# EAGLE design akabeacon_circle_MDBT40_type4 (EAGLE 9.6.2)
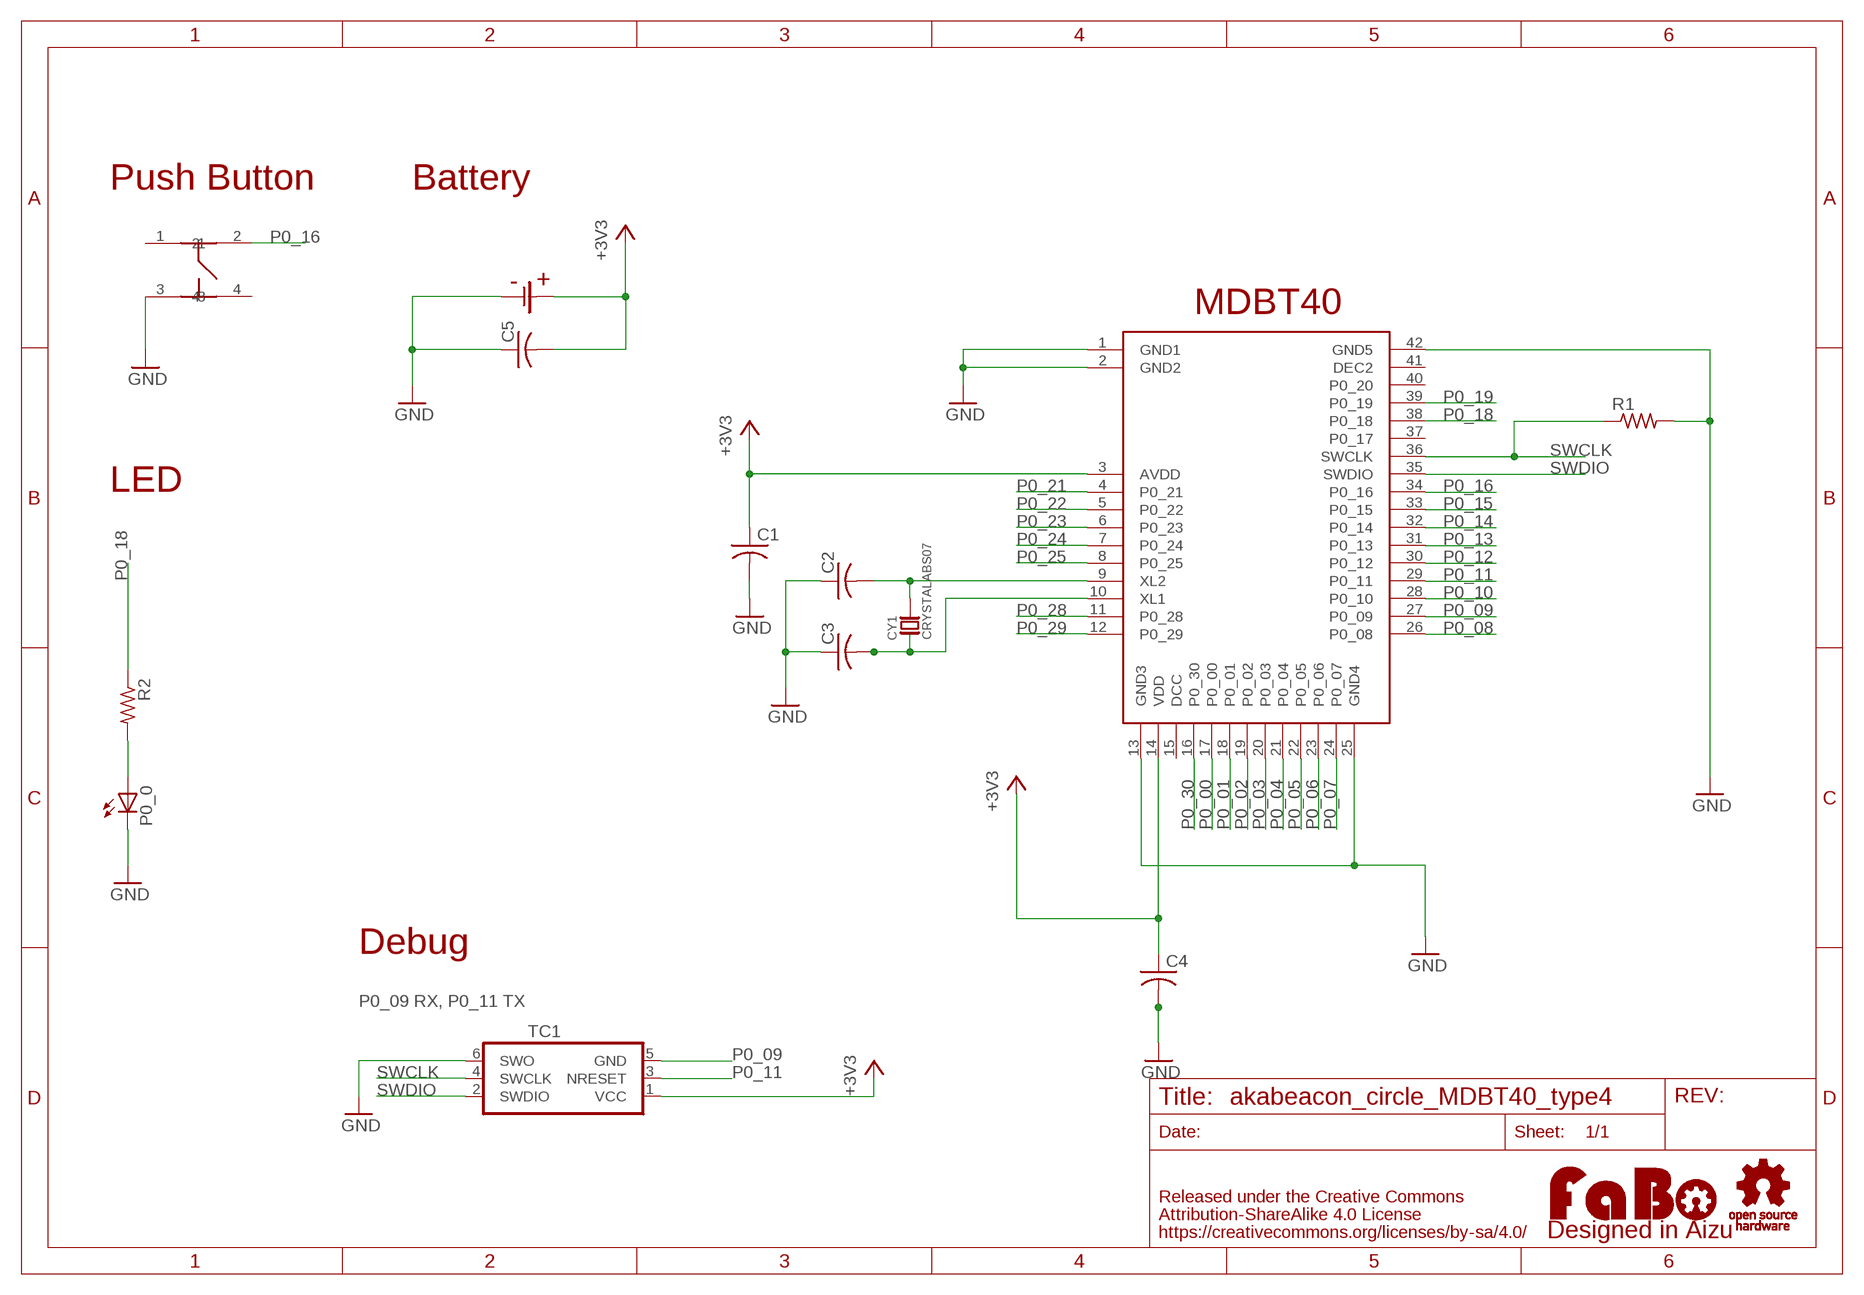
[diagram p0: schematic, sheet 1]

## Parts
C1  C-USC0603  [C0603]
C2  C-USC0603  [C0603]
C3  C-USC0603  [C0603]
C4  C-USC0603  [C0603]
C5  C-USC0603  [C0603]
CY1  CRYSTALABS07  [ABRACOM-ABS07-32.768KHZ]
P0_0  LEDCHIP-LED0603  [CHIP-LED0603]
R1  R-US_R0603  [R0603]
R2  R-US_R0603  [R0603]
TC1  TC2030-IDC-NL  [TC2030-IDC-NL]
U$1  RAYTAC-MDBT40  [RAYTAC-MDBT40]
U$2  SMTU-TOP2032  [SMTU-2032]
U$3  LOGO_FABO-M  [LOGO_FABO_MS]
U$4  LOGO_OSHW-M_BOTTOM  [LOGO_OSHW_M_BOTTOM]
U$5  SWICTH-4P(KMR2)  [SWITCH-4P(KMR2)]

## Nets
+3V3: C1.1 C4.1 C5.2 TC1.1(VCC) U$1.3(AVDD) U$1.14(VDD) U$2.+
GND: C1.2 C2.1 C3.1 C4.2 C5.1 P0_0.C R1.2 TC1.6(SWO) U$1.1(GND1) U$1.2(GND2) U$1.13(GND3) U$1.25(GND4) U$1.42(GND5) U$2.- U$5.3
N$1: P0_0.A R2.2
N$7: C2.2 CY1.P$2 U$1.9(XL2)
N$8: C3.2 CY1.P$1 U$1.10(XL1)
P0_00: U$1.17(P0_00)
P0_01: U$1.18(P0_01)
P0_02: U$1.19(P0_02)
P0_03: U$1.20(P0_03)
P0_04: U$1.21(P0_04)
P0_05: U$1.22(P0_05)
P0_06: U$1.23(P0_06)
P0_07: U$1.24(P0_07)
P0_08: U$1.26(P0_08)
P0_09: TC1.5(GND) U$1.27(P0_09)
P0_10: U$1.28(P0_10)
P0_11: TC1.3(NRESET) U$1.29(P0_11)
P0_12: U$1.30(P0_12)
P0_13: U$1.31(P0_13)
P0_14: U$1.32(P0_14)
P0_15: U$1.33(P0_15)
P0_16: U$1.34(P0_16) U$5.2
P0_18: R2.1 U$1.38(P0_18)
P0_19: U$1.39(P0_19)
P0_21: U$1.4(P0_21)
P0_22: U$1.5(P0_22)
P0_23: U$1.6(P0_23)
P0_24: U$1.7(P0_24)
P0_25: U$1.8(P0_25)
P0_28: U$1.11(P0_28)
P0_29: U$1.12(P0_29)
P0_30: U$1.16(P0_30)
SWCLK: R1.1 TC1.4(SWCLK) U$1.36(SWCLK)
SWDIO: TC1.2(SWDIO) U$1.35(SWDIO)
Unconnected: U$1.15(DCC) U$1.37(P0_17) U$1.40(P0_20) U$1.41(DEC2) U$5.1 U$5.4

## Notes on the sheet
- Push Button | Battery
- MDBT40
- LED
- Debug
- P0_09 RX, P0_11 TX

## Library data of the parts
C1-C5 = adafruit:C-US: CAPACITOR, American symbol
CY1 = FaBo-Crystal:CRYSTAL
P0_0 = led:LED: LED OSRAM: - CHIPLED LG R971, LG N971, LY N971, LG Q971, LY Q971, LO R971, LY R971 LH N974, LH R974 LS Q976, LO Q976, LY Q976 LO Q996 - Hyper CHIPLED LW Q18S LB Q993, LB Q99A, LB R99A - SideLED LS A670, LO A670, LY A670, LG A670, LP A670 LB A673, LV A673, LT A673, LW A673 LH A674 LY A675 LS A676, LA A676, LO A676, LY A676, LW A676 LS A679, LY A679, LG A679 - Hyper Micro SIDELED® LS Y876, LA Y876, LO Y876, LY Y876 LT Y87S - SmartLED LW L88C, LW L88S LB L89C, LB L89S, LG L890 LS L89K, LO L89K, LY L89K LS L896, LA L896, LO L896, LY L896 - TOPLED LS T670, LO T670, LY T670, LG T670, LP T670 LSG T670, LSP T670, LSY T670, LOP T670, LYG T670 LG T671, LOG T671, LSG T671 LB T673, LV T673, LT T673, LW T673 LH T674 LS T676, LA T676, LO T676, LY T676, LB T676, LH T676, LSB T676, LW T676 LB T67C, LV T67C, LT T67C, LS T67K, LO T67K, LY T67K, LW E67C LS E67B, LA E67B, LO E67B, LY E67B, LB E67C, LV E67C, LT E67C LW T67C LS T679, LY T679, LG T679 LS T770, LO T770, LY T770, LG T770, LP T770 LB T773, LV T773, LT T773, LW T773 LH T774 LS E675, LA E675, LY E675, LS T675 LS T776, LA T776, LO T776, LY T776, LB T776 LHGB T686 LT T68C, LB T68C - Hyper Mini TOPLED® LB M676 - Mini TOPLED Santana® LG M470 LS M47K, LO M47K, LY M47K Source: http://www.osram.convergy.de LUXEON: - LUMILED® LXK2-PW12-R00, LXK2-PW12-S00, LXK2-PW14-U00, LXK2-PW14-V00 LXK2-PM12-R00, LXK2-PM12-S00, LXK2-PM14-U00 LXK2-PE12-Q00, LXK2-PE12-R00, LXK2-PE12-S00, LXK2-PE14-T00, LXK2-PE14-U00 LXK2-PB12-K00, LXK2-PB12-L00, LXK2-PB12-M00, LXK2-PB14-N00, LXK2-PB14-P00, LXK2-PB14-Q00 LXK2-PR12-L00, LXK2-PR12-M00, LXK2-PR14-Q00, LXK2-PR14-R00 LXK2-PD12-Q00, LXK2-PD12-R00, LXK2-PD12-S00 LXK2-PH12-R00, LXK2-PH12-S00 LXK2-PL12-P00, LXK2-PL12-Q00, LXK2-PL12-R00 Source: www.luxeon.com KINGBRIGHT: KA-3528ASYC Source: www.kingbright.com
R1 R2 = adafruit:R-US_: RESISTOR, American symbol
TC1 = TagConnect:TC2030-IDC: Tag-Connect In Circuit Programming & Debug Cable 6 Pin http://www.tag-connect.com
U$1 = FaBo-BT:RAYTAC-MDBT40
U$2 = FaBo-Supply:SMTU-TOP
U$3 = FaBo-Logo:LOGO_FABO
U$4 = FaBo-Logo:LOGO_OSHW
U$5 = gclue-test:SWICTH-4P(KMR2)

## Board
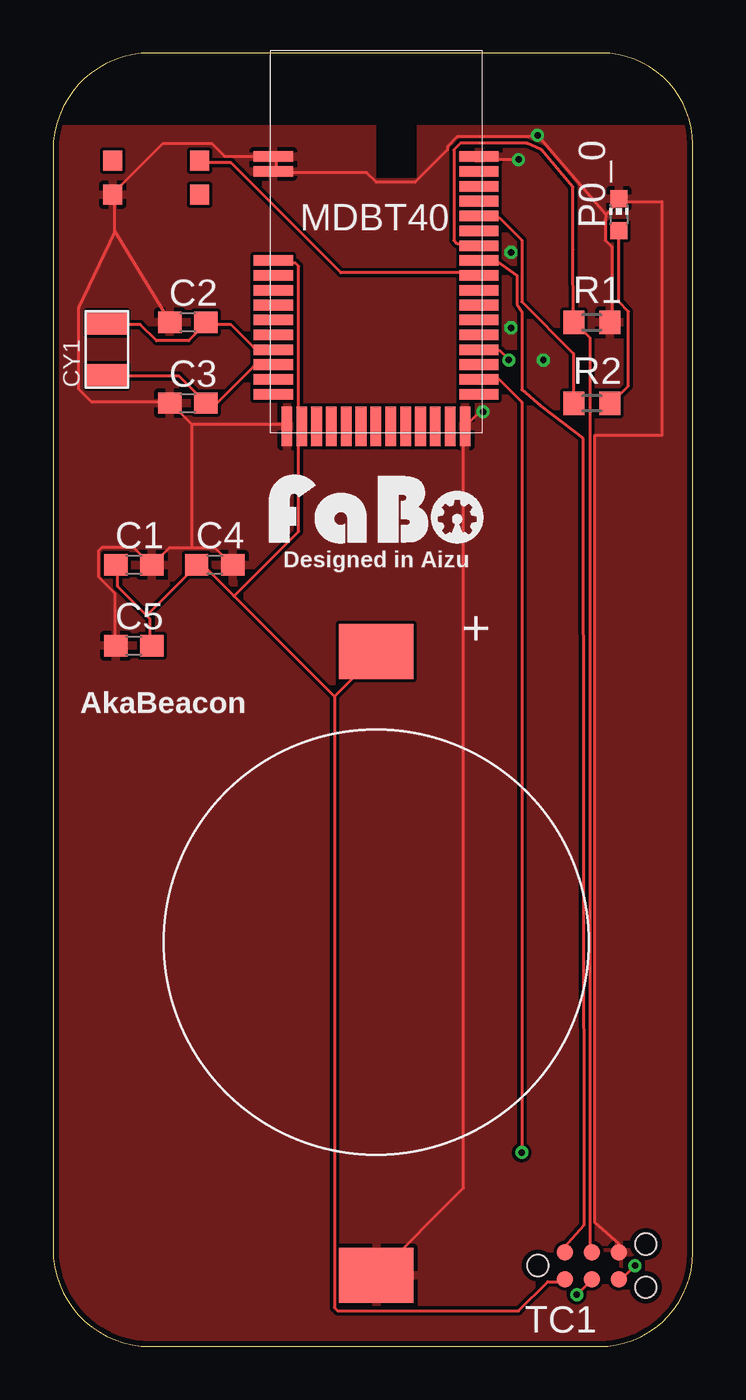
[diagram p1: board, top side]
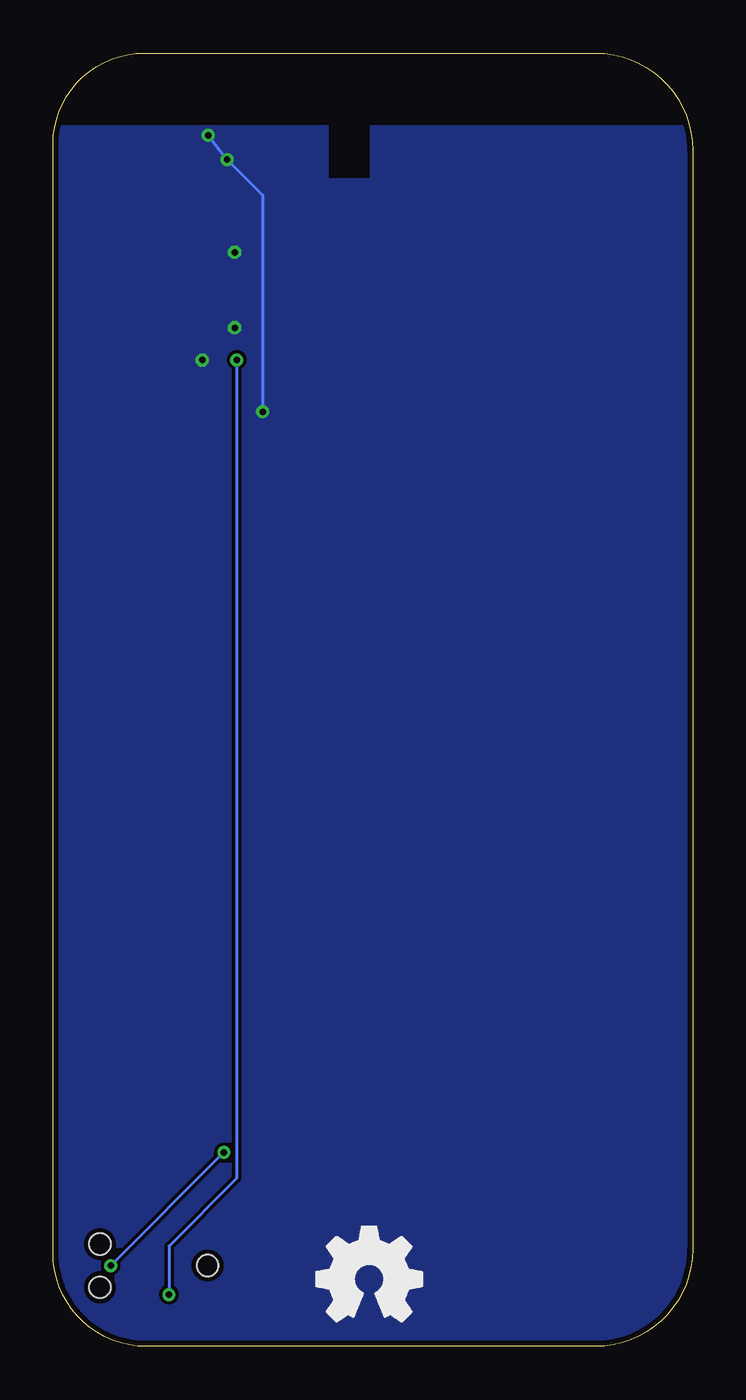
[diagram p2: board, bottom side, seen from below]

Size 30.15 x 60.95 mm. Coordinates in mm from the lower left corner, seen from the top.
Outline: 25.85,60.95 4.57,60.95 arc90 0,56.38 0,4.58 arc90 4.58,0 25.75,0 arc90 30.15,4.41 30.15,56.65 arc90 25.85,60.95
Copper layers (1*16): Top 0.035mm / dielectric 1.6mm / Bottom 0.035mm
Design rules "PCBway": minimum track width 6mil, minimum drill 12mil, track to track 6mil, track to pad 6mil, pad to pad 6mil, via to via 6mil, smd to smd 6mil, copper to edge 10mil, drill to drill 10mil, minimum pad ring 10mil, minimum via ring 6mil, stop-mask expansion 2mil, vias tented up to drill 100mil, thermal gap 8mil

### Footprints (pad centres in the part's own frame; a part is rotated, then mirrored left to right if it is on the bottom)
C0603 = smd 1.1 x 1: 1 -0.85,0; 2 0.85,0
ABRACOM-ABS07-32.768KHZ = smd 1.1 x 1.9: P$1 -1.25,0; P$2 1.25,0
CHIP-LED0603 = smd 0.8 x 0.8: A 0,-0.75; C 0,0.75
R0603 = smd 1 x 1.1: 1 -0.85,0; 2 0.85,0
TC2030-IDC-NL = smd 0.787 x 0.787: 1 -1.27,-0.635; 2 -1.27,0.635; 3 0,-0.635; 4 0,0.635; 5 1.27,-0.635; 6 1.27,0.635 | hole 0.991: -2.54,0; 2.54,1.016; 2.54,-1.016
RAYTAC-MDBT40 = smd 1.85 x 0.5: 1 -4.86,4; 2 -4.86,3.3; 3 -4.86,-0.9; 4 -4.86,-1.6; 5 -4.86,-2.3; 6 -4.86,-3; 7 -4.86,-3.7; 8 -4.86,-4.4; 9 -4.86,-5.1; 10 -4.86,-5.8; 11 -4.86,-6.5; 12 -4.86,-7.2; 26 4.84,-7.2; 27 4.84,-6.5; 28 4.84,-5.8; 29 4.84,-5.1; 30 4.84,-4.4; 31 4.84,-3.7; 32 4.84,-3; 33 4.84,-2.3; 34 4.84,-1.6; 35 4.84,-0.9; 36 4.84,-0.2; 37 4.84,0.5; 38 4.84,1.2; 39 4.84,1.9; 40 4.84,2.6; 41 4.84,3.3; 42 4.84,4 | smd 0.5 x 1.85: 13 -4.22,-8.71; 14 -3.52,-8.71; 15 -2.82,-8.71; 16 -2.12,-8.71; 17 -1.42,-8.71; 18 -0.72,-8.71; 19 -0.02,-8.71; 20 0.68,-8.71; 21 1.38,-8.71; 22 2.08,-8.71; 23 2.78,-8.71; 24 3.48,-8.71; 25 4.18,-8.71
SMTU-2032 = smd 3.5 x 2.6: + 0,13.7; - 0,-15.7
SWITCH-4P(KMR2) = smd 0.9 x 0.95: 1 -1,0; 2 3.1,0; 3 -1,-1.6; 4 3.1,-1.6

### Placement (x,y rotation side)
C1  3.81,36.83 0 top
C2  6.35,48.26 0 top
C3  6.35,44.45 0 top
C4  7.62,36.83 0 top
C5  3.81,33.02 0 top
CY1  2.54,46.99 90 top
P0_0  26.67,53.34 0 top
R1  25.4,48.26 0 top
R2  25.4,44.45 0 top
TC1  25.4,3.81 0 top
U$1  15.24,52.07 0 top
U$2  15.24,19.05 0 top
U$3  15.24,37.47 0 top
U$4  15.24,3.17 0 top
U$5  3.81,55.88 0 top

### Tracks (layer width: path | path; a pad name or v marks a point on that pad's centre or on a via)
+3V3
  Top 0.152: U$1.3 10.52,51.05 11.43,51.05 11.58,50.9 11.58,43.43 U$1.14 11.58,43.28 11.58,38.41 8.53,35.36 | 4.42,34.44 4.57,34.29 4.57,33.07 C5.2 | 4.42,34.44 3.05,35.81 3.05,36.73 C1.1 | 4.42,34.44 6.71,36.73 C4.1 6.86,36.73 7.16,36.73 8.53,35.36 | 13.26,30.63 13.26,1.83 13.41,1.68 21.95,1.68 23.32,3.05 24.08,3.05 TC1.1 | 13.26,30.63 15.24,32.61 U$2.+ | 13.26,30.63 8.53,35.36
GND  (via drill 0.3)
  Top 0.152: U$2.- 19.36,7.47 19.36,43.28 U$1.25 19.51,43.43 20.12,44.04 v20.27,44.04 | 2.92,52.53 5.49,48.31 C2.1 | 2.92,52.53 2.9,52.43 2.9,54.25 U$5.3 2.9,54.41 5.18,56.69 7.47,56.69 8.08,56.08 10.36,56.08 U$1.1 10.52,55.93 10.52,55.47 U$1.2 10.52,55.32 14.78,55.32 15.24,54.86 17.07,54.86 18.59,56.39 18.59,56.54 19.05,57 22.4,57 v22.84,57.07 26.06,53.34 | 6.55,43.43 5.64,44.35 C3.1 5.49,44.5 1.83,44.5 1.22,45.11 1.22,48.92 2.92,52.53 | 6.55,43.43 10.97,43.43 U$1.13 | C5.1 2.9,33.07 2.9,35.51 2.13,36.27 2.13,37.49 2.29,37.64 3.81,37.64 4.57,36.88 C1.2 4.72,36.88 5.49,37.64 6.55,37.64 | 6.55,37.64 7.62,37.64 8.38,36.88 C4.2 | 6.55,37.64 6.55,43.43 | TC1.6 26.67,4.83 25.53,5.84 25.53,42.93 28.7,42.93 28.7,53.95 26.67,53.95 | 26.67,53.95 26.06,53.34 | 26.06,53.34 26.04,53.06 26.04,52.12 26.34,51.82 26.34,48.18 R1.2 | 26.67,53.95 P0_0.C | v21.95,55.93 20.12,55.93 U$1.42
  Bottom 0.152: v22.84,57.07 v21.95,55.93 20.27,54.25 v20.27,44.04
  other vias: 23.11,46.48 21.59,48.01 21.59,51.56
  pour Bottom: 0,-0.51 30.23,-0.51 30.23,61.21 0,61.21
  pour Top: 0.1,0 30.15,0 30.15,61.21 0,61.21 0,-0.1
N$1
  Top 0.152: P0_0.A 26.67,49.23 27.13,48.77 27.13,45.26 26.36,44.5 R2.2
N$7
  Top 0.152: U$1.9 10.36,47.09 9.45,47.09 8.38,48.16 7.32,48.16 C2.2 7.16,48.16 6.4,47.4 4.88,47.4 4.12,48.16 2.59,48.16 CY1.P$2
N$8
  Top 0.152: U$1.10 10.36,46.18 9.45,46.18 7.77,44.5 7.32,44.5 C3.2 7.16,44.5 5.94,45.72 2.59,45.72 CY1.P$1
P0_09  (via drill 0.3)
  Top 0.152: v27.43,3.81 26.67,3.05 TC1.5 | v22.1,9.14 22.1,44.5 21.03,45.57 20.12,45.57 U$1.27
  Bottom 0.152: v22.1,9.14 v27.43,3.81
P0_11  (via drill 0.3)
  Top 0.152: v24.69,2.44 25.3,3.05 TC1.3 | v21.49,46.48 21.03,46.94 20.12,46.94 U$1.29
  Bottom 0.152: v24.69,2.44 24.69,4.72 21.49,7.92 v21.49,46.48
P0_16
  Top 0.152: U$5.2 7.01,55.78 8.38,55.78 13.56,50.6 19.96,50.6 U$1.34
P0_18
  Top 0.152: R2.1 24.54,44.5 24.54,46.79 22.1,49.23 22.1,52.12 21.03,53.19 20.12,53.19 U$1.38
SWCLK
  Top 0.152: TC1.4 25.3,4.57 25.3,47.55 24.69,48.16 R1.1 24.54,48.31 24.51,51.69 24.51,54.63 23.01,56.39 22.33,56.69 19.2,56.69 18.9,56.39 18.9,52.12 19.05,51.97 19.96,51.97 U$1.36
SWDIO
  Top 0.152: TC1.2 24.08,4.57 24.08,4.65 25.02,5.71 24.97,42.8 22.99,44.32 22.1,45.09 22.1,48.77 21.87,49.12 21.87,50.47 21.03,51.05 20.12,51.05 U$1.35

### Text on the board
tPlace: Designed in Aizu | AkaBeacon